# Altium schematic sheet Top.SchDoc
size A; Author: E. Sims; Organization: Let's Build Rockets Inc.; SheetNumber: 1; SheetTotal: 2
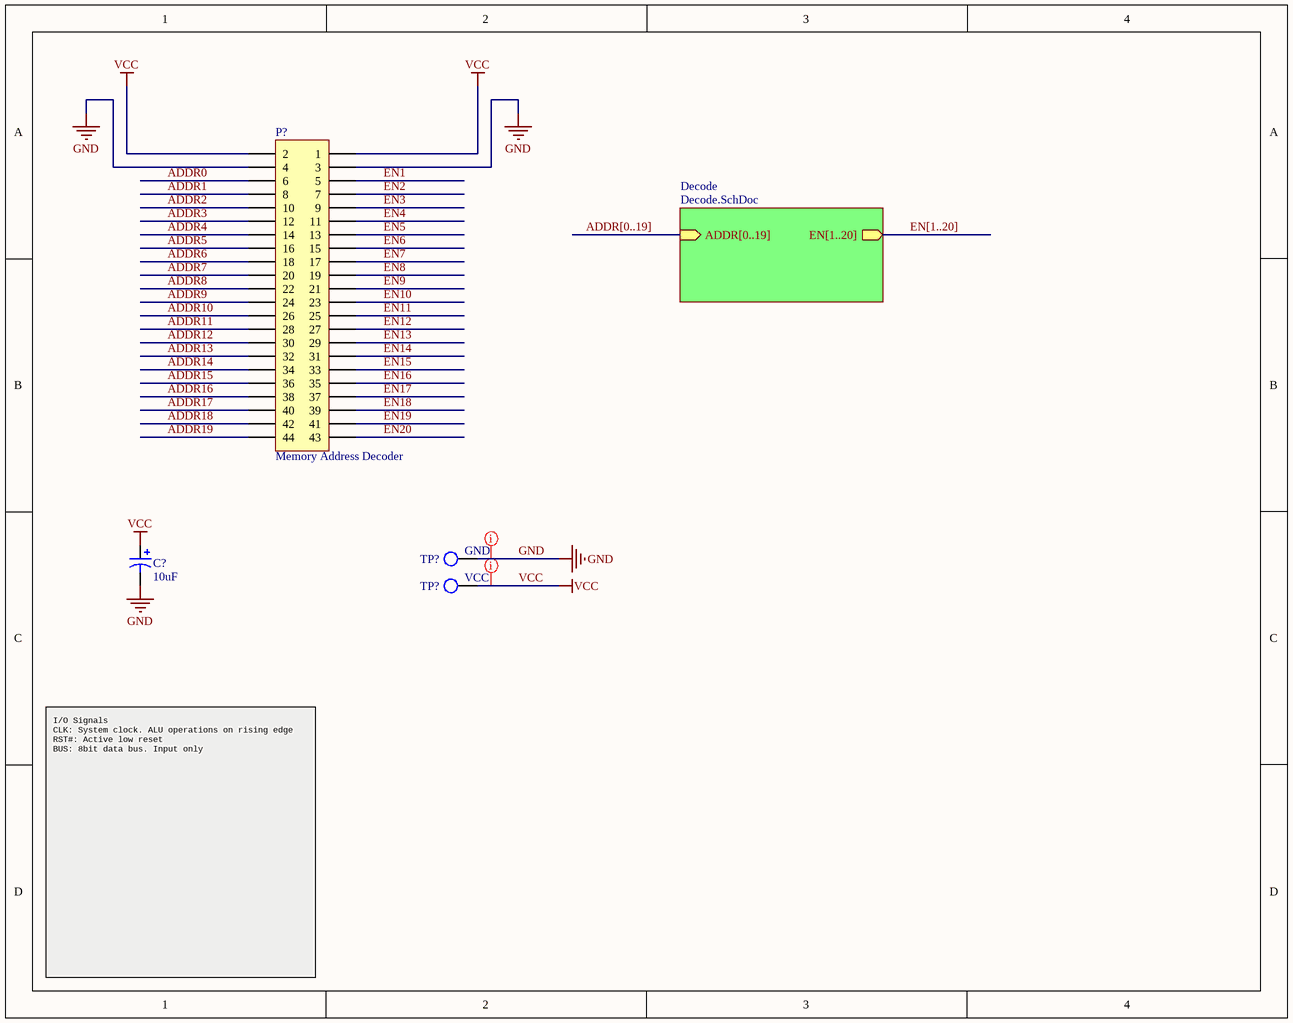
[diagram p0: Top.SchDoc]

## Parts
(Parts that share a designator on the sheet are numbered #1, #2 ... from top to bottom, then left to right.)
C?  value 10uF  [C5x7]  (hidden comment: Cap Pol5)
P?  Memory Address Decoder  [HDR2X22H]
TP?#1  GND  [KSTN-5011_V]  (no BOM)
TP?#2  VCC  [KSTN-5011_V]  (no BOM)

## Sub-sheets
Decode = Decode.SchDoc: EN[1..20] (out), ADDR[0..19] (in)

## Nets
GND: C?.2 P?.3 P?.4 TP?#1.1
VCC: C?.1 P?.1 P?.2 TP?#2.1
ADDR0: P?.6
ADDR1: P?.8
ADDR2: P?.10
ADDR3: P?.12
ADDR4: P?.14
ADDR5: P?.16
ADDR6: P?.18
ADDR7: P?.20
ADDR8: P?.22
ADDR9: P?.24
ADDR10: P?.26
ADDR11: P?.28
ADDR12: P?.30
ADDR13: P?.32
ADDR14: P?.34
ADDR15: P?.36
ADDR16: P?.38
ADDR17: P?.40
ADDR18: P?.42
ADDR19: P?.44
EN1: P?.5
EN2: P?.7
EN3: P?.9
EN4: P?.11
EN5: P?.13
EN6: P?.15
EN7: P?.17
EN8: P?.19
EN9: P?.21
EN10: P?.23
EN11: P?.25
EN12: P?.27
EN13: P?.29
EN14: P?.31
EN15: P?.33
EN16: P?.35
EN17: P?.37
EN18: P?.39
EN19: P?.41
EN20: P?.43

## Buses and harness runs
bus ADDR[0..19] = sheet Decode/ADDR[0..19]
bus EN[1..20] = sheet Decode/EN[1..20]

## Layout directives
rule Width Constraint [Pref Width = 20mil    Min Width = 20mil    Max Width = 50mil]; rule Routing Via Style [Pref Size = 35mil    Pref Hole Size = 20mil]; net class PWR: GND, VCC

## Notes on the sheet
- I/O Signals
  CLK: System clock. ALU operations on rising edge
  RST#: Active low reset
  BUS: 8bit data bus. Input only
- Let's Build Rocket's Inc. Modular Paylaod System Based on TMP-010 Rev
  For more information visit https://github.com/LetsBuildRockets/Modular-Payload-System
  This work is licensed under CC BY-NC 4.0. To view a copy of this license, visit https://creativecommons.org/licenses/by-nc/4.0
- Title
- Size:
- Date:
- Assembly Variant:
- B
- Number:
- Time:
- Revision:
- Sheet
- of
- Author:
- File:

## Library data of the parts
C? = Cap Pol5: Polarized Capacitor; Published: 8-Jun-2000; LatestRevisionDate: 17-Jul-2002; LatestRevisionNote: Re-released for DXP Platform.; PackageReference: POLAR0.8; Publisher: Altium Limited; PackageDescription: Polarized Capacitor; 2 Leads
P? = Header 22X2H: Header, 22-Pin, Dual row, Right Angle; System: Connector; LatestRevisionDate: 17-Jul-2002; LatestRevisionNote: Re-released for DXP Platform.; Publisher: Altium Limited
TP?#1 TP?#2 = TP